# EAGLE design LH_ MRF24_Module (EAGLE 6.3)
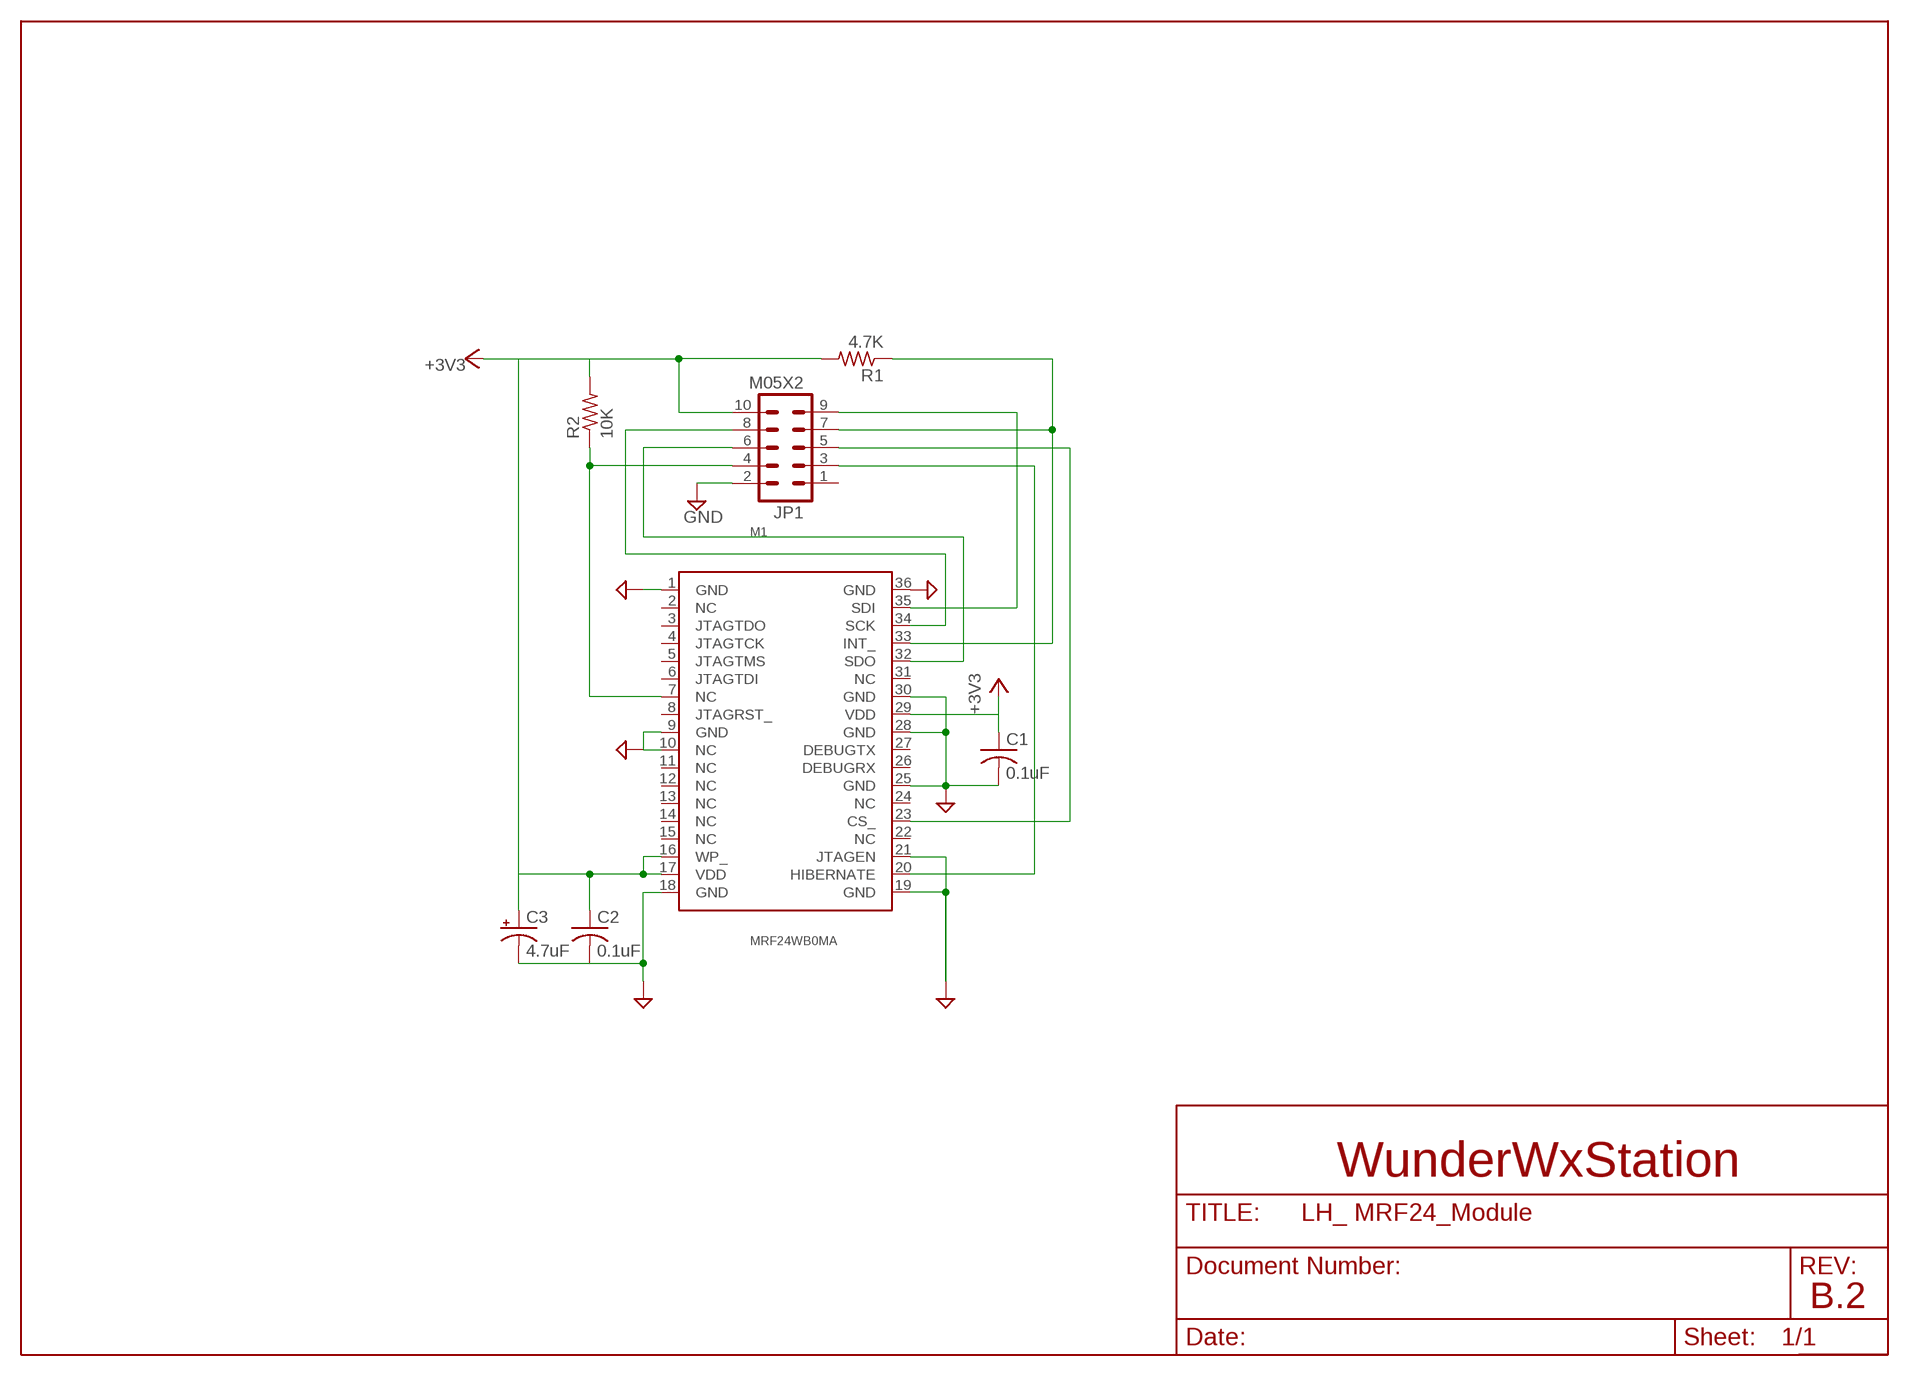
[diagram p0: schematic, sheet 1]

## Parts
C1  0.1uF  C-USC0805  [C0805]
C2  0.1uF  C-USC0805  [C0805]
C3  4.7uF  CPOL-USR/2012-12R  [R/2012-12R]
JP1  M05X2  [2X5-RA-HEADER]
M1  MRF24WB0MA  MR24WB0MA  [MRF24W]
R1  4.7K  R-US_R0603  [R0603]
R2  10K  R-US_R0603  [R0603]

## Nets
+3V3: C1.1 C2.1 C3.+ JP1.10 M1.16(WP_) M1.17(VDD) M1.29(VDD) R1.2 R2.2
CS_: JP1.5 M1.23(CS_)
GND: C1.2 C2.2 C3.- JP1.2 M1.1(GND) M1.9(GND) M1.10(NC) M1.18(GND) M1.19(GND) M1.21(JTAGEN) M1.25(GND) M1.28(GND) M1.30(GND) M1.36(GND)
HIBER: JP1.3 M1.20(HIBERNATE)
INT_: JP1.7 M1.33(INT_) R1.1
RESET_: JP1.4 M1.7(NC) R2.1
SCK: JP1.8 M1.34(SCK)
SDI: JP1.9 M1.35(SDI)
SDO: JP1.6 M1.32(SDO)
Unconnected: JP1.1 M1.2(NC) M1.3(JTAGTDO) M1.4(JTAGTCK) M1.5(JTAGTMS) M1.6(JTAGTDI) M1.8(JTAGRST_) M1.11(NC) M1.12(NC) M1.13(NC) M1.14(NC) M1.15(NC) M1.22(NC) M1.24(NC) M1.26(DEBUGRX) M1.27(DEBUGTX) M1.31(NC)

## Notes on the sheet
- WunderWxStation
- B.2

## Library data of the parts
C1 C2 = rcl:C-US: CAPACITOR, American symbol
C3 = rcl:CPOL-US: POLARIZED CAPACITOR, American symbol
JP1 = wifi_WX:M05X2: Header 5x2 Standard 10-pin dual row 0.1" header. Commonly used with AVR-ISP. Use with Spark Fun Electronics SKU: PRT-00778
M1 = 1AA_Stofer:MR24WB0MA
R1 R2 = rcl:R-US_: RESISTOR, American symbol

## Board
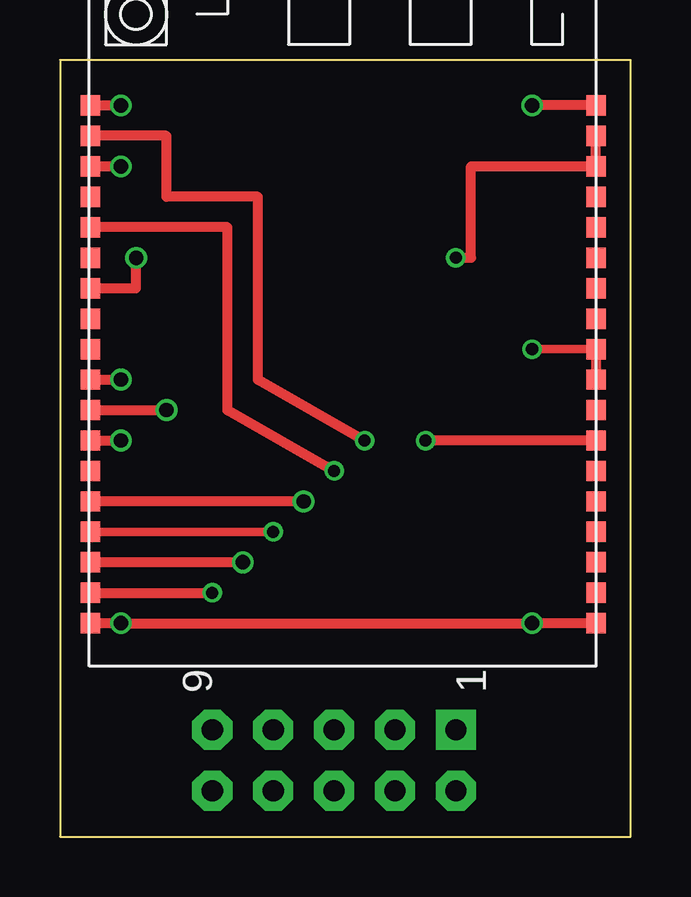
[diagram p1: board, top side]
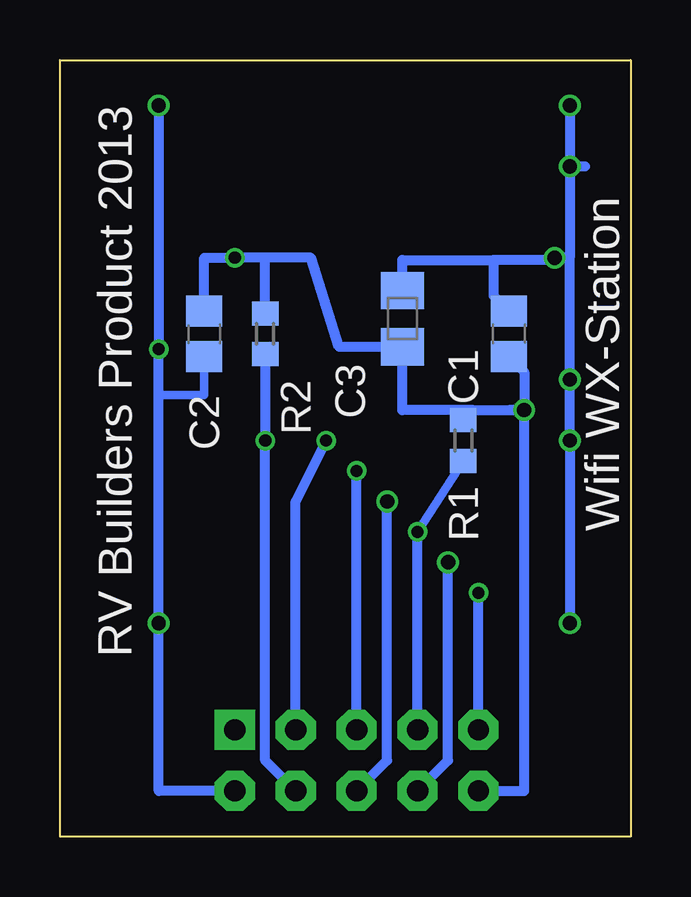
[diagram p2: board, bottom side, seen from below]

Size 23.8 x 32.38 mm. Coordinates in mm from the lower left corner, seen from the top.
Outline: 0,0 23.8,0 23.8,32.38 0,32.38 0,0
Copper layers (1*16): Top 0.035mm / dielectric 1.5mm / Bottom 0.035mm
Design rules "Elecrow_2-layer_with reduced cream mask": minimum track width 6mil, minimum drill 12mil, track to track 6mil, track to pad 6mil, pad to pad 6mil, via to via 6mil, smd to smd 0mil, copper to edge 10mil, drill to drill 10mil, minimum pad ring 10mil, minimum via ring 6mil, stop-mask expansion 2mil, vias tented up to drill 100mil, thermal gap 10mil

### Footprints (pad centres in the part's own frame; a part is rotated, then mirrored left to right if it is on the bottom)
C0805 = smd 1.3 x 1.5: 1 -0.95,0; 2 0.95,0
R/2012-12R = smd 1.55 x 1.8: + 1.175,0; - -1.175,0
2X5-RA-HEADER = drill 0.889 pad 1.676 square: 1 -1.27,5.08 | drill 0.889 pad 1.676 octagon: 2 1.27,5.08; 3 -1.27,2.54; 4 1.27,2.54; 5 -1.27,0; 6 1.27,0; 7 -1.27,-2.54; 8 1.27,-2.54; 9 -1.27,-5.08; 10 1.27,-5.08
MRF24W = smd 0.8 x 0.85: 1 -0.127,29.21; 2 -0.127,27.94; 3 -0.127,26.67; 4 -0.127,25.4; 5 -0.127,24.13; 6 -0.127,22.86; 7 -0.127,21.59; 8 -0.127,20.32; 9 -0.127,19.05; 10 -0.127,17.78; 11 -0.127,16.51; 12 -0.127,15.24; 13 -0.127,13.97; 14 -0.127,12.7; 15 -0.127,11.43; 16 -0.127,10.16; 17 -0.127,8.89; 18 -0.127,7.62; 19 20.955,7.62; 20 20.955,8.89; 21 20.955,10.16; 22 20.955,11.43; 23 20.955,12.7; 24 20.955,13.97; 25 20.955,15.24; 26 20.955,16.51; 27 20.955,17.78; 28 20.955,19.05; 29 20.955,20.32; 30 20.955,21.59; 31 20.955,22.86; 32 20.955,24.13; 33 20.955,25.4; 34 20.955,26.67; 35 20.955,27.94; 36 20.955,29.21
R0603 = smd 1 x 1.1: 1 -0.85,0; 2 0.85,0

### Placement (x,y rotation side)
C1  5.08,20.96 90 bottom
C2  17.78,20.96 270 bottom
C3  9.53,21.59 270 bottom
JP1  11.43,3.17 270 top
M1  22.23,38.1 180 top
R1  6.99,16.51 90 bottom
R2  15.24,20.96 90 bottom

### Tracks (layer width: path | path; a pad name or v marks a point on that pad's centre or on a via)
+3V3  (via drill 0.51, 0.6)
  Top 0.406: M1.29 v4.45,17.78 | v16.51,24.13 17.15,24.13 17.15,27.94 M1.16 M1.17
  Bottom 0.406: v4.45,17.78 5.08,17.78 | R1.2 6.57,17.78 | 6.57,17.78 v4.45,17.78 | R2.2 15.24,24.13 | 15.24,24.13 v16.51,24.13 17.78,24.13 C2.1 | JP1.10 4.45,1.9 v4.45,17.78 | 6.57,17.78 9.53,17.78 C3.+ 12.16,20.41 13.34,24.13 15.24,24.13 | C1.1 4.45,19.37 v4.45,17.78
CS_  (via drill 0.51)
  Top 0.406: M1.23 6.99,25.4 6.99,17.78 v11.43,15.24
  Bottom 0.406: JP1.5 v11.43,15.24
GND  (via drill 0.51, 0.6)
  Top 0.356: M1.10 v19.69,20.32
  Top 0.406: M1.10 M1.9 | M1.25 3.18,22.86 v3.18,24.13 | M1.18 v19.69,30.48 | M1.1 v19.69,8.89 v2.54,8.89 M1.36 | M1.19 v2.54,30.48 | M1.28 v2.54,19.05 | M1.21 v2.54,27.94 | M1.30 v2.54,16.51
  Bottom 0.356: 19.69,18.41 17.78,18.41 C2.2
  Bottom 0.406: v19.69,30.48 v19.69,20.32 19.69,18.41 v19.69,8.89 19.69,1.9 JP1.2 | v2.54,30.48 v2.54,27.94 | v2.54,27.94 1.91,27.94 | v2.54,27.94 2.54,24.13 | 2.54,24.13 v3.18,24.13 3.27,24.04 5.72,24.04 | 2.54,24.13 v2.54,19.05 v2.54,16.51 v2.54,8.89 | C1.2 5.72,22.54 5.72,24.04 | C3.- 9.53,24.04 5.72,24.04
HIBER  (via drill 0.51)
  Top 0.406: M1.20 4.45,29.21 4.45,26.67 8.26,26.67 8.26,19.05 v12.7,16.51
  Bottom 0.406: v12.7,16.51 13.97,13.97 JP1.3
INT_  (via drill 0.51)
  Top 0.356: M1.33 v8.89,12.7
  Bottom 0.356: R1.1 v8.89,12.7
  Bottom 0.406: JP1.7 v8.89,12.7
RESET_  (via drill 0.51)
  Top 0.406: M1.7 v15.24,16.51
  Bottom 0.406: R2.1 v15.24,16.51 15.24,3.17 JP1.4
SCK  (via drill 0.6)
  Top 0.406: v7.62,11.43 M1.34
  Bottom 0.406: JP1.8 7.62,3.17 v7.62,11.43
SDI  (via drill 0.51)
  Top 0.406: M1.35 v6.35,10.16
  Bottom 0.406: JP1.9 v6.35,10.16
SDO  (via drill 0.6)
  Top 0.406: v10.16,13.97 M1.32
  Bottom 0.406: JP1.6 10.16,3.17 v10.16,13.97

### Text on the board
bNames: RV Builders Product 2013 | Wifi WX-Station
Drill_legend: Drill legend | Date: 1/27/2013 12:12:52 PM | 1 different diameters with default symbols! (10 drills) | 0.8890 mm / 35.000 mil | 0.6000 mm / 23.622 mil | 0.5080 mm / 20.000 mil